# Altium project Glucometer-InstrumentationCircuit.PrjPcb
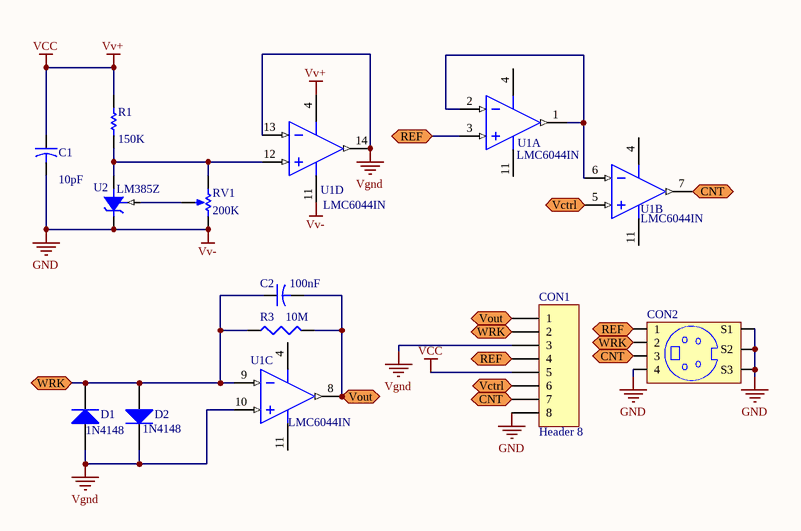
[diagram p0: Glucometer-InstrumentationCircuit.SchDoc]
1 sheet, 11 parts. Net scope: flat (ports and power ports of the same name join across sheets).
Board files: Glucometer-InstrumentationCircuit.PcbDoc, Glucometer-InstrumentationCircuit-1Cara.PcbDoc

## Sheet Glucometer-InstrumentationCircuit.SchDoc
size A4; PageSetup: Record=PageOptions|CenterHorizontal=True|CenterVertical=True|PrintScale=1.00|XCorrection=1.00|YCorrection=1.00|PrintKind=1|BorderSize=5000000|LeftOffset=0|BottomOffset=0|Orientation=1|PaperLength=1000|PaperWidth=1000|Scale=100|PaperSource=7|PrintQuality=-4|MediaType=1|DitherType=10|PaperKind=A4|PrintScaleMode=1

### Parts
C1  value 10pF  [CAPR5-4X5]  (hidden comment: Cap2)
C2  value 100nF  [CAPR5-4X5]  (hidden comment: Cap2)
CON1  Header 8  [HDR1X8]
CON2  (no value)  [CDIN2.6-3H4A]
D1  1N4148  [DO-35]
D2  1N4148  [DO-35]
R1  value 150K  [AXIAL-0.3]  (hidden comment: Res1)
R3  value 10M  [AXIAL-0.3]  (hidden comment: Res3)
RV1  value 200K  [VR5]  (hidden comment: RPot)
U1  LMC6044IN  [N14A]  (parts A,B,C,D of 4)
U2  LM385Z  [LP03]

### Ports
CNT, REF, Vctrl, Vout, WRK

### Nets
GND: C1.2 CON1.8 CON2.4 CON2.MH1(S1) CON2.MH2(S2) CON2.MH3(S3) RV1.2(BOT) U1.11(V-) U2.2(+V)  [also labelled Vv-]
VCC: C1.1 CON1.5 R1.2 U1.4(V+)  [also labelled Vv+]
Vgnd: CON1.3 D1.1(A) D2.2(K) U1.10(IN3+) U1.13(IN4-) U1.14(OUT4)
NetC2_1: C2.1 CON1.2 CON2.2 D1.2(K) D2.1(A) R3.1 U1.9(IN3-) ; port WRK
NetC2_2: C2.2 CON1.1 R3.2 U1.8(OUT3) ; port Vout
NetCON1_4: CON1.4 CON2.1 U1.3(IN1+) ; port REF
NetCON1_6: CON1.6 U1.5(IN2+) ; port Vctrl
NetCON1_7: CON1.7 CON2.3 U1.7(OUT2) ; port CNT
NetR1_1: R1.1 RV1.1(TOP) U1.12(IN4+) U2.3(-V)
NetRV1_3: RV1.3(TAP) U2.1(FB)
NetU1_1: U1.1(OUT1) U1.2(IN1-) U1.6(IN2-)

### Library data of the parts
C1 C2 = Cap2: Capacitor; Published: 23-Sep-2002; PackageReference: CAPR5-4X5; Publisher: Altium Limited; PackageDescription: Capacitor; 2 Leads
CON1 = Header 8: Header, 8-Pin; LatestRevisionDate: 17-Jul-2002; LatestRevisionNote: Re-released for DXP Platform.; Publisher: Altium Limited
CON2 = MiniDin 4Pins - SuperVideo: MiniDin 4 Pins
D1 D2 = 1N4148: High Conductance Fast Diode; Published: 8-Jun-2000; LatestRevisionDate: 17-Jul-2002; LatestRevisionNote: Re-released for DXP Platform.; DatasheetDocument: 1997; PackageReference: DO-35; Publisher: Altium Limited; Code_JEDEC: DO-204-AH; ComponentLink1Description: Manufacturer Link; ComponentLink1URL: http://www.fairchildsemi.com/; ComponentLink2Description: Datasheet; ComponentLink2URL: http://www.fairchildsemi.com/ds/1N%2F1N4148.pdf
R1 = Res1: Resistor; Published: 8-Jun-2000; LatestRevisionDate: 17-Jul-2002; LatestRevisionNote: Re-released for DXP Platform.; PackageReference: AXIAL-0.3; Publisher: Altium Limited; PackageDescription: Axial Device, Thru-Hole; 2 Leads; 0.3 in Pin Spacing
R3 = Res3: Resistor; Published: 8-Jun-2000; LatestRevisionDate: 29-May-2009; LatestRevisionNote: IPC-7351 Footprint Added.; PackageReference: J1-0603; Publisher: Altium Limited; PackageDescription: Chip Resistor
RV1 = RPot: Potentiometer; pin to pad: 2>3 3>2; Sim Note: Enter the Resistance value and the set point into parameter fields.; Set Position: 0.5; Published: 8-Jun-2000; LatestRevisionDate: 17-Jul-2002; LatestRevisionNote: Re-released for DXP Platform.; PackageReference: VR5; Publisher: Altium Limited; PackageDescription: Variable Resistor, Thru-Hole; 3 Leads
U1 = LMC6044IN: CMOS Quad Micropower Operational Amplifier, 14-pin MDIP; Manufacturer: National Semiconductor; PackageTopMarking: NSUZXYYTTE#*LMC6044IN; PowerWise: Y; CompType: Amplifiers; Published: 4-Dec-2008; LatestRevisionDate: 13-Jan-2009; LatestRevisionNote: Sim Model Added.; DatasheetVersion: Aug-2000; PackageVersion: revG, May-2006; PackageReference: N14A; Publisher: Altium Limited; PackageDescription: MDIP, .750 x .250 x.130in, 14 Lead, .100in Pitch; Supplier 1: Farnell; Supplier Part Number 1: 9494634; PartNumber: LMC6044IN; RoHS: N; PinCount: 14; Code_JEDEC: MS-001-AA; ComponentLink1Description: LMC6044 Datasheet; ComponentLink1URL: http://www.national.com/ds/LM/LMC6044.pdf; ComponentLink2Description: LMC6044 Web Page; ComponentLink2URL: http://www.national.com/pf/LM/LMC6044.html; ComponentLink3Description: N14A Package Page; ComponentLink3URL: http://www.national.com/packaging/folders/n14a.html
U2 = LM385Z: Adjustable Micropower Voltage Reference, 3-pin TO-92; Manufacturer: National Semiconductor; PackageTopMarking: NSXYTT*LM385*Z; PowerWise: N; CompType: Voltage Reference IC; Published: 4-Dec-2008; LatestRevisionDate: 15-Jul-2009; LatestRevisionNote: Sch pins 1 & 3 reversed.; DatasheetVersion: Jan-2008; PackageVersion: revG, Sep-2000; PackageReference: Z03A; Publisher: Altium Limited; PackageDescription: TO-92, Molded, 3 Lead; Supplier 1: Farnell; Supplier Part Number 1: 9488529; PartNumber: LM385Z; RoHS: N; PinCount: 3; Code_JEDEC: TO-226-AA; ComponentLink1Description: LM385-ADJ Datasheet; ComponentLink1URL: http://www.national.com/ds/LM/LM385-ADJ.pdf; ComponentLink2Description: LM385-ADJ Web Page; ComponentLink2URL: http://www.national.com/pf/LM/LM385-ADJ.html; ComponentLink3Description: Z03A Package Page; ComponentLink3URL: http://www.national.com/packaging/folders/z03a.html